# EAGLE schematic flux (EAGLE 6.4)
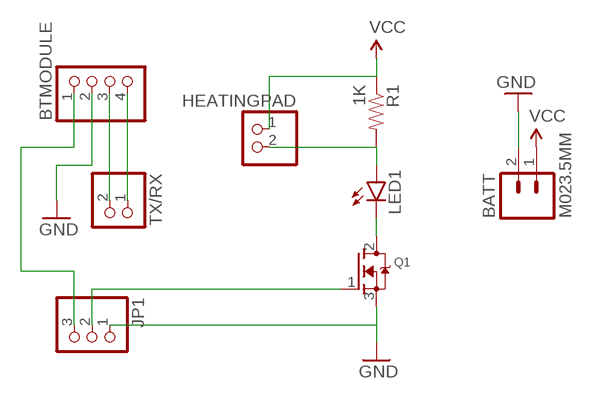
[diagram p0: schematic, sheet 1]

## Parts
BATT  M023.5MM  [SCREWTERMINAL-3.5MM-2]
BTMODULE  PINHD-1X4  [1X04]
HEATINGPAD  PINHD-1X2  [1X02]
JP1  PINHD-1X3  [1X03]
LED1  LED3MM  [LED3MM]
Q1  MOSFET-NGDS_TO220V  [TO220V]
R1  1K  1KOHM-1/4W-1%(PTH)  [AXIAL-0.3]
TX/RX  PINHD-1X2  [1X02]

## Nets
GND: BATT.2 BTMODULE.2 JP1.1 Q1.3(S)
N$1: HEATINGPAD.2 LED1.A R1.P$2
N$2: LED1.K(C) Q1.2(D)
N$3: BTMODULE.1 JP1.3
N$4: JP1.2 Q1.1(G)
N$5: BTMODULE.3 TX/RX.2
N$6: BTMODULE.4 TX/RX.1
VCC: BATT.1 HEATINGPAD.1 R1.P$1

## Library data of the parts
BATT = SparkFun-Connectors:M02: Standard 2-pin 0.1" header. Use with - straight break away headers ( PRT-00116) - right angle break away headers (PRT-00553) - swiss pins (PRT-00743) - machine pins (PRT-00117) - female headers (PRT-00115) Molex polarized connector foot print use with: PRT-08233 with associated crimp pins and housings. 2.54_SCREWTERM for use with PRT-10571. 3.5mm Screw Terminal footprints for PRT-08084 5mm Screw Terminal footprints for use with PRT-08432
BTMODULE = pinhead:PINHD-1X4: PIN HEADER
HEATINGPAD TX/RX = pinhead:PINHD-1X2: PIN HEADER
JP1 = pinhead:PINHD-1X3: PIN HEADER
LED1 = SparkFun-LED:LED: LEDs Standard schematic elements and footprints for 5mm, 3mm, 1206, and 0603 sized LEDs. 5mm - Spark Fun Electronics SKU : COM-00529 (and others)
Q1 = adafruit:MOSFET-N: N-Channel Mosfet 2N7002E - 60V 260mA SOT23 [Digikey: 2N7002ET1GOSTR-ND] - REEL BSH103 - 30V 850mA SOT23 [Digikey: 568-5013-1-ND]
R1 = SparkFun-Resistors:1KOHM-1/4W-1%(PTH): RES-12182; PROD_ID: RES-12182

## Net classes
0 default: width 0.305 mm, drill 0.508 mm, clearance 0.254 mm